# Altium schematic sheet TOF_VGA.SchDoc: =project_title
size Tabloid; CompanyName: Luxonis Holding; Organization: Luxonis Holding; Address1: 1925 Harmony Park Drive; Address2: Westminster, CO; Address3: 80234; Address4: United States; SheetNumber: 12; SheetTotal: 14
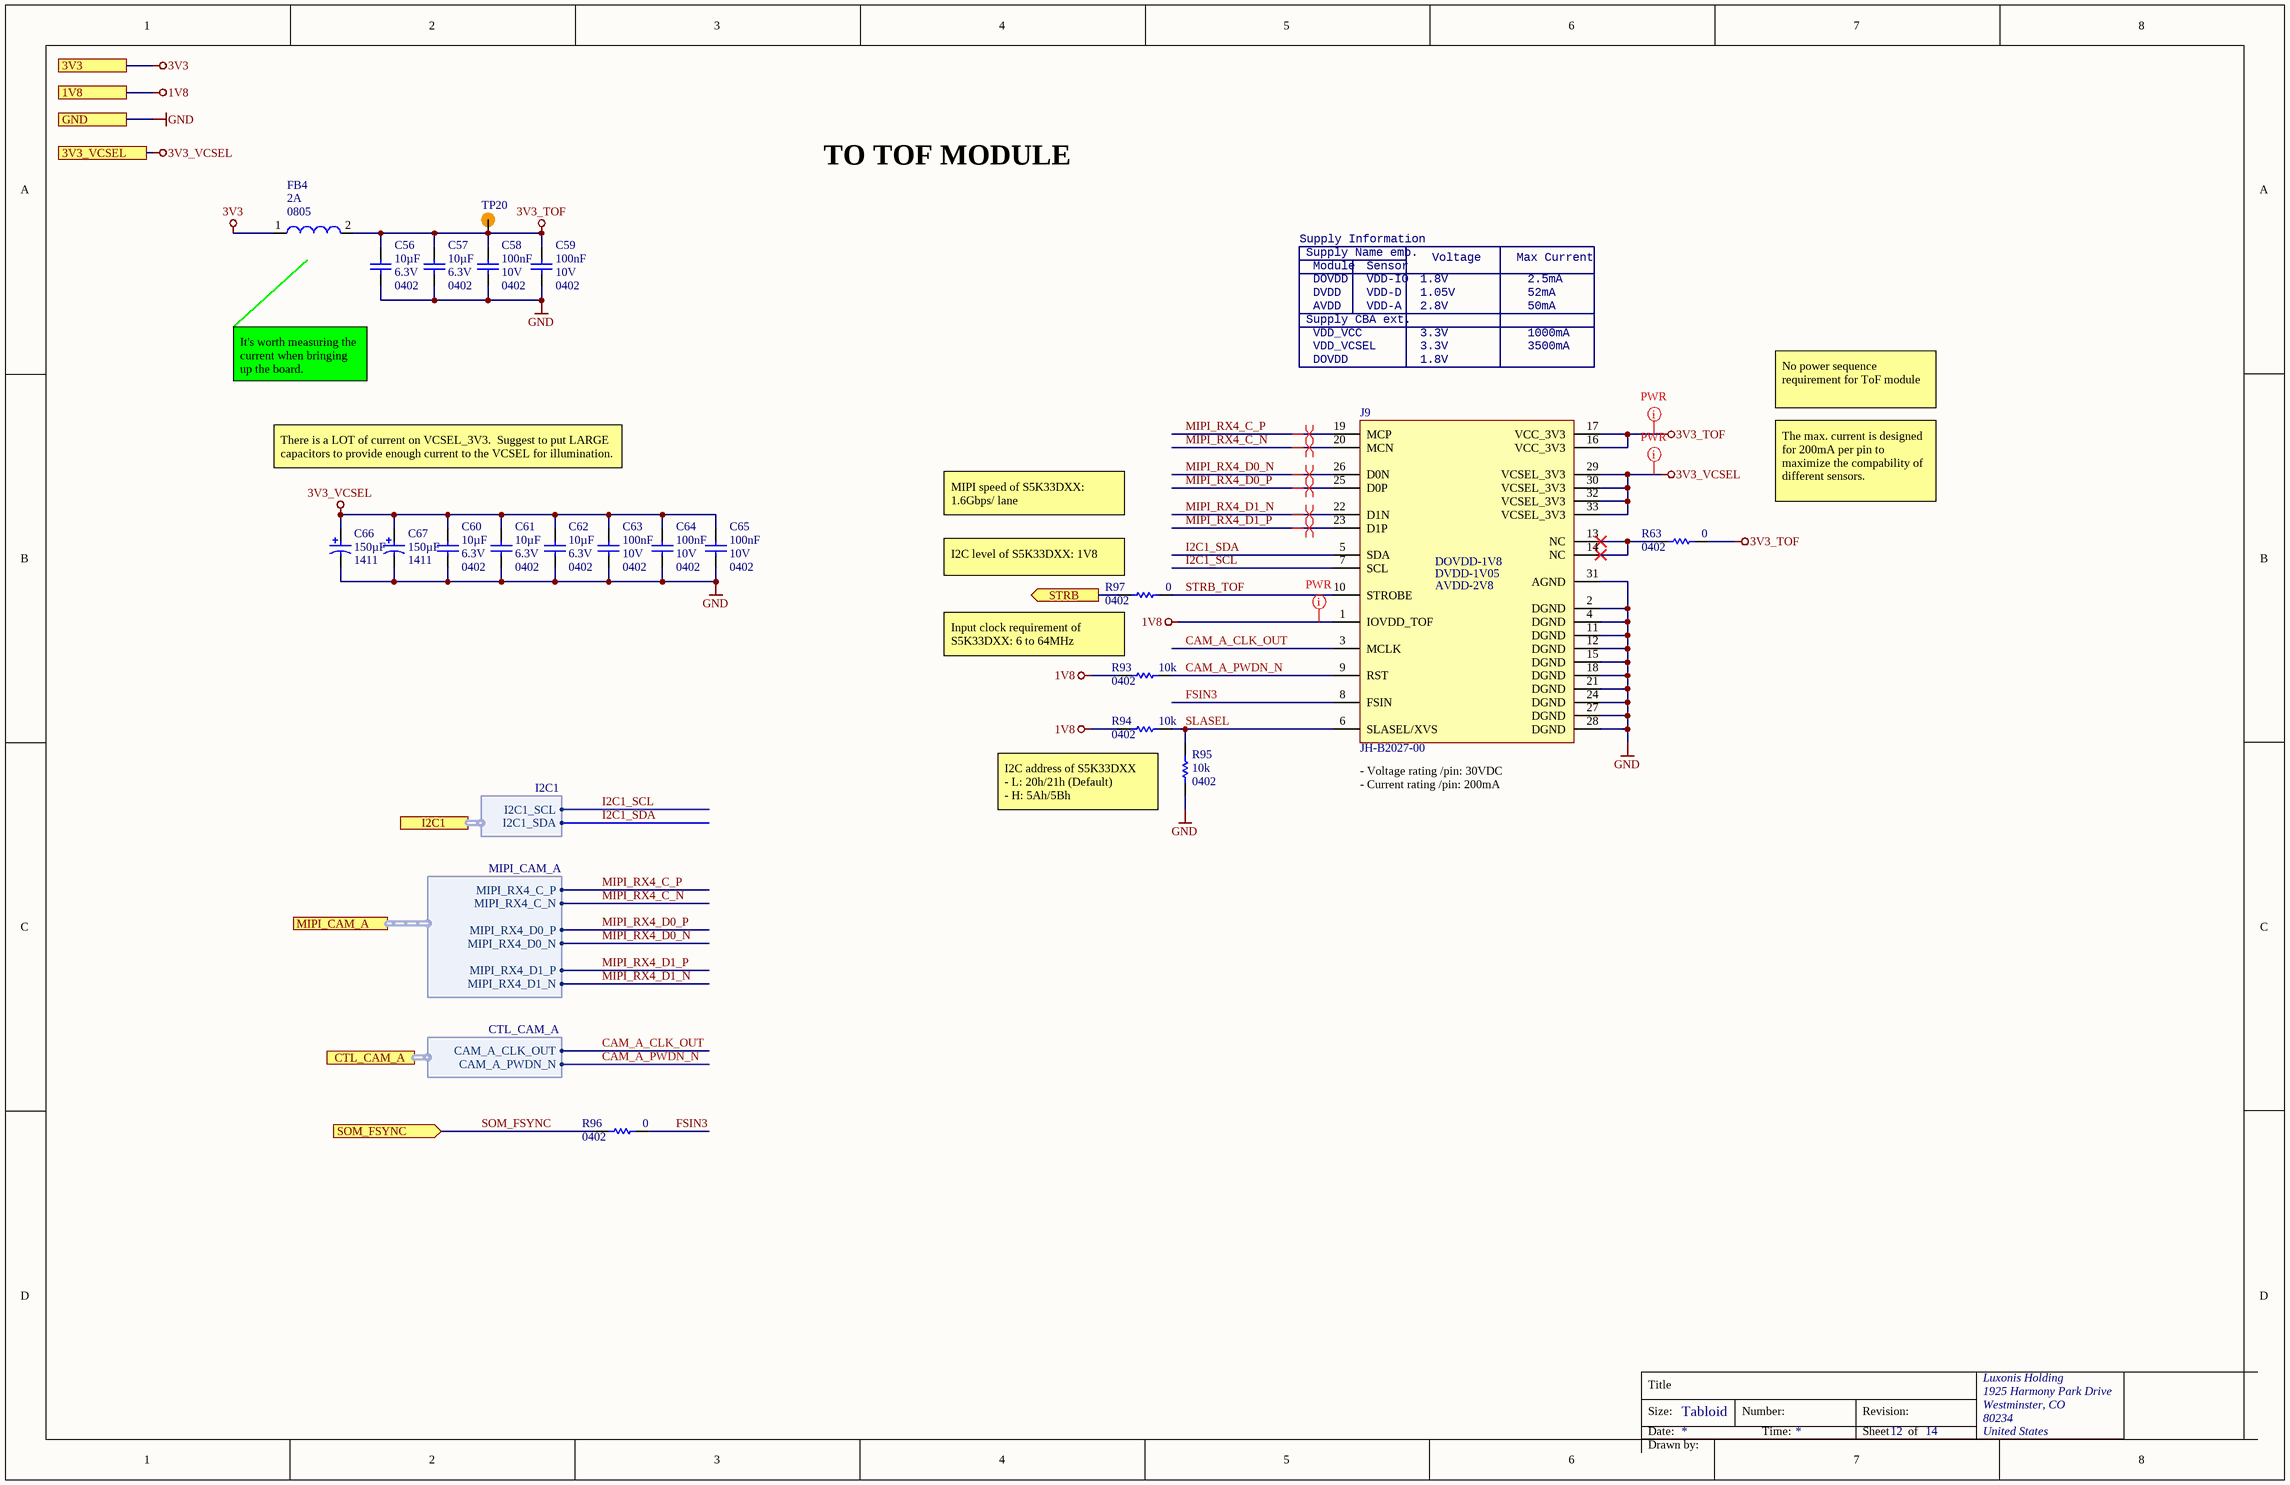
[diagram p0: TOF_VGA.SchDoc]

## Parts
C56  value 10µF  Case/Package: 0402  Voltage Rating: 6.3V  [CAPC0402(1005)70_N]  (hidden comment: GRM155R60J106ME15D)
C57  value 10µF  Case/Package: 0402  Voltage Rating: 6.3V  [CAPC0402(1005)70_N]  (hidden comment: GRM155R60J106ME15D)
C58  value 100nF  Voltage Rating: 10V  Case/Package: 0402  [CAPC0402(1005)70_N]  (hidden comment: GRM155R71A104JA01D)
C59  value 100nF  Voltage Rating: 10V  Case/Package: 0402  [CAPC0402(1005)70_N]  (hidden comment: GRM155R71A104JA01D)
C60  value 10µF  Case/Package: 0402  Voltage Rating: 6.3V  [CAPC0402(1005)70_N]  (hidden comment: GRM155R60J106ME15D)
C61  value 10µF  Case/Package: 0402  Voltage Rating: 6.3V  [CAPC0402(1005)70_N]  (hidden comment: GRM155R60J106ME15D)
C62  value 10µF  Case/Package: 0402  Voltage Rating: 6.3V  [CAPC0402(1005)70_N]  (hidden comment: GRM155R60J106ME15D)
C63  value 100nF  Voltage Rating: 10V  Case/Package: 0402  [CAPC0402(1005)70_N]  (hidden comment: GRM155R71A104JA01D)
C64  value 100nF  Voltage Rating: 10V  Case/Package: 0402  [CAPC0402(1005)70_N]  (hidden comment: GRM155R71A104JA01D)
C65  value 100nF  Voltage Rating: 10V  Case/Package: 0402  [CAPC0402(1005)70_N]  (hidden comment: GRM155R71A104JA01D)
C66  value 150µF  Case/Package: 1411  [RESTL1210(3225)_L]  (hidden comment: TLJB157M010R0500)
C67  value 150µF  Case/Package: 1411  [RESTL1210(3225)_L]  (hidden comment: TLJB157M010R0500)
FB4  Case/Package: 0805  Current Rating: 2A  [2508056017Y2]  (hidden comment: 2508056017Y2)
J9  JH-B2027-00  [PCBComponent_1]
R63  value 0  Case/Package: 0402  [RESC0402(1005)_L]  (hidden comment: CRCW04020000Z0ED)
R93  value 10k  Case/Package: 0402  [RESC0402(1005)_N]  (hidden comment: RC0402FR-1310KL)
R94  value 10k  Case/Package: 0402  [RESC0402(1005)_N]  (hidden comment: RC0402FR-1310KL)
R95  value 10k  Case/Package: 0402  [RESC0402(1005)_N]  (hidden comment: RC0402FR-1310KL)
R96  value 0  Case/Package: 0402  [RESC0402(1005)_L]  (hidden comment: CRCW04020000Z0ED)
R97  value 0  Case/Package: 0402  [RESC0402(1005)_L]  (hidden comment: CRCW04020000Z0ED)
TP20  TEST_POINT  [TP075_150_NS]  (value not drawn)  (no BOM)

## Ports
1V8, 3V3, 3V3_VCSEL, CTL_CAM_A (harness CTL_CAM_A), GND, I2C1 (harness I2C1), MIPI_CAM_A (harness MIPI_CAM_A), SOM_FSYNC (in), STRB (out)

## Harnesses
CTL_CAM_A: CAM_A_PWDN_N, CAM_A_CLK_OUT
MIPI_CAM_A: MIPI_RX4_C_P, MIPI_RX4_C_N, MIPI_RX4_D0_P, MIPI_RX4_D0_N, MIPI_RX4_D1_P, MIPI_RX4_D1_N
I2C1: I2C1_SDA, I2C1_SCL

## Nets
1V8: J9.1(IOVDD_TOF) R93.1 R94.1 ; port 1V8
3V3: FB4.1 ; port 3V3
3V3_TOF: C56.2 C57.2 C58.2 C59.2 FB4.2 J9.16(VCC_3V3) J9.17(VCC_3V3) R63.1 TP20.1
3V3_VCSEL: C60.2 C61.2 C62.2 C63.2 C64.2 C65.2 C66.1 C67.1 J9.29(VCSEL_3V3) J9.30(VCSEL_3V3) J9.32(VCSEL_3V3) J9.33(VCSEL_3V3) ; port 3V3_VCSEL
GND: C56.1 C57.1 C58.1 C59.1 C60.1 C61.1 C62.1 C63.1 C64.1 C65.1 C66.2 C67.2 J9.2(DGND) J9.4(DGND) J9.11(DGND) J9.12(DGND) J9.15(DGND) J9.18(DGND) J9.21(DGND) J9.24(DGND) J9.27(DGND) J9.28(DGND) J9.31(AGND) R95.1 ; port GND
CAM_A_CLK_OUT: J9.3(MCLK) ; port CTL_CAM_A.CAM_A_CLK_OUT
CAM_A_PWDN_N: J9.9(RST) R93.2 ; port CTL_CAM_A.CAM_A_PWDN_N
FSIN3: J9.8(FSIN) R96.1
I2C1_SCL: J9.7(SCL) ; port I2C1.I2C1_SCL
I2C1_SDA: J9.5(SDA) ; port I2C1.I2C1_SDA
MIPI_RX4_C_N: J9.20(MCN) ; port MIPI_CAM_A.MIPI_RX4_C_N
MIPI_RX4_C_P: J9.19(MCP) ; port MIPI_CAM_A.MIPI_RX4_C_P
MIPI_RX4_D0_N: J9.26(D0N) ; port MIPI_CAM_A.MIPI_RX4_D0_N
MIPI_RX4_D0_P: J9.25(D0P) ; port MIPI_CAM_A.MIPI_RX4_D0_P
MIPI_RX4_D1_N: J9.22(D1N) ; port MIPI_CAM_A.MIPI_RX4_D1_N
MIPI_RX4_D1_P: J9.23(D1P) ; port MIPI_CAM_A.MIPI_RX4_D1_P
SLASEL: J9.6(SLASEL/XVS) R94.2 R95.2
SOM_FSYNC: R96.2 ; port SOM_FSYNC
STRB: R97.2 ; port STRB
STRB_TOF: J9.10(STROBE) R97.1
NetJ9_13: J9.13(NC) J9.14(NC) R63.2

## Layout directives
differential pair; net class MIPI; differential pair class 100ohm: MIPI_RX4_C_N, MIPI_RX4_C_P, MIPI_RX4_D0_N, MIPI_RX4_D0_P, MIPI_RX4_D1_N, MIPI_RX4_D1_P
net class PWR; Current Rating: 3A: 3V3_VCSEL
net class PWR; Current Rating: 1A: 3V3_TOF
net class PWR; Current Rating: 200mA: 1V8

## Notes on the sheet
- TO TOF MODULE
- Supply Information
- Supply Name emb.
- DOVDD
- DVDD
- Module
- VDD-IO
- VDD-D
- Sensor
- 1.8V
- 1.05V
- Voltage
- Max Current
- 2.5mA
- 52mA
- Supply CBA ext.
- AVDD
- VDD_VCSEL
- VDD_VCC
- VDD-A
- 2.8V
- 3.3V
- 50mA
- 1000mA
- 3500mA
- It's worth measuring the current when bringing up the board.
- No power sequence requirement for ToF module
- There is a LOT of current on VCSEL_3V3.  Suggest to put LARGE capacitors to provide enough current to the VCSEL for illumination.
- The max. current is designed for 200mA per pin to maximize the compability of different sensors.
- (near R97) I2C level of S5K33DXX: 1V8
- MIPI speed of S5K33DXX: 1.6Gbps/ lane
- Input clock requirement of S5K33DXX: 6 to 64MHz
- I2C address of S5K33DXX
  - L: 20h/21h (Default)
  - H: 5Ah/5Bh
- (near J9) - Voltage rating /pin: 30VDC
  - Current rating /pin: 200mA
- Title
- Size:
- Date:
- Tabloid
- Number:
- Time:
- Revision:
- Sheet
- of
- Drawn by:
- (in symbol CMP-002-00132-2) DOVDD-1V8; DVDD-1V05; AVDD-2V8

## Library data of the parts
C56 C57 C60-C62 = CMP-004-000009-5: CAP CER 10UF 6.3V X5R 0402 20%; Manufacturer 1: Murata; Manufacturer Part Number 1: GRM155R60J106ME15D; Min Operating Temperature: -55°C; Max Operating Temperature: 85°C; Dielectric: X5R; Length: 0.039inch; Width: 0.02inch; ComponentLink1URL: https://www.murata.com/~/media/webrenewal/support/library/catalog/products/capacitor/mlcc/c02e.ashx?la=en-us&src-supplier=Digi-Key; ComponentLink1Description: https://www.murata.com/~/media/webrenewal/support/library/catalog/products/capacitor/mlcc/c02e.ashx?la=en-us&src-supplier=Digi-Key; Tolerance: 20%; Design Item ID: GRM155R60J106ME15D; Mounting Technology: SMT
C58 C59 C63-C65 = CMP-108-000015-5: CAP CER 0.1UF 10V X7R 0402 5%; Manufacturer 1: Murata; Dielectric: X7R; Tolerance: 5%; Min Operating Temperature: -55°C; Mounting Technology: SMT; Max Operating Temperature: 125°C; Depth: 0.5mm; Height: 0.5mm; ComponentLink2Description: https://datasheet.ciiva.com/11618/c02e-11618821.pdf?src-supplier=Avnet; Length: 1mm; Width: 0.02inch; ComponentLink1URL: https://datasheet.ciiva.com/5411/product-5411135.pdf?src-supplier=Mouser; Design Item ID: GRM155R71A104JA01D; ComponentLink1Description: https://datasheet.ciiva.com/5411/product-5411135.pdf?src-supplier=Mouser; Manufacturer Part Number 1: GRM155R71A104JA01D; ComponentLink2URL: https://datasheet.ciiva.com/11618/c02e-11618821.pdf?src-supplier=Avnet
C66 C67 = CMP-050-000000-4: CAP TAL 150UF 10V 20%; Manufacturer 1: Kyocera AVX; Capacitor Type: Tantalum; Polarity: Polarized; ComponentLink5Description: https://datasheet.ciiva.com/46385/1910903-46385237.pdf?src-supplier=Element14; Manufacturer Part Number 1: TLJB157M010R0500; Min Operating Temperature: -55°C; ComponentLink6Description: https://datasheet.ciiva.com/28515/tlj-28515528.pdf?src-supplier=Element14; ComponentLink4URL: https://datasheet.ciiva.com/264/tlj-264788.pdf?src-supplier=Digi-Key; ComponentLink5URL: https://datasheet.ciiva.com/46385/1910903-46385237.pdf?src-supplier=Element14; Length: 3.5mm; ComponentLink2URL: https://datasheet.ciiva.com/264/tlj-264786.pdf?src-supplier=Digi-Key; ComponentLink10URL: https://datasheet.ciiva.com/7773/1533257-7773834.pdf?src-supplier=Element14; ComponentLink11URL: https://datasheet.ciiva.com/11229/tlj-11229389.pdf?src-supplier=Avnet; Design Item ID: TLJB157M010R0500; ComponentLink10Description: https://datasheet.ciiva.com/7773/1533257-7773834.pdf?src-supplier=Element14; ComponentLink11Description: https://datasheet.ciiva.com/11229/tlj-11229389.pdf?src-supplier=Avnet; ComponentLink12URL: https://datasheet.ciiva.com/17339/tlj-17339422.pdf?src-supplier=Avnet+Europe; Mounting Technology: SMT; ComponentLink3URL: https://datasheet.ciiva.com/264/tlj-264787.pdf?src-supplier=Digi-Key; ComponentLink1Description: https://datasheet.ciiva.com:443/pdfs/VipMasterIC/IC/AVXC/AVXC-S-A0008508048/AVXC-S-A0008508048-1.pdf?src-supplier=IHS+Markit; ComponentLink12Description: https://datasheet.ciiva.com/17339/tlj-17339422.pdf?src-supplier=Avnet+Europe; ComponentLink7Description: https://datasheet.ciiva.com/7773/1533257-7773833.pdf?src-supplier=Element14; ComponentLink3Description: https://datasheet.ciiva.com/264/tlj-264787.pdf?src-supplier=Digi-Key; Max Operating Temperature: 125°C; Voltage Rating: 10V; ComponentLink8Description: https://datasheet.ciiva.com/14593/70001364-14593673.pdf?src-supplier=Allied+Electronics; Width: 2.8mm; ComponentLink2Description: https://datasheet.ciiva.com/264/tlj-264786.pdf?src-supplier=Digi-Key; ComponentLink7URL: https://datasheet.ciiva.com/7773/1533257-7773833.pdf?src-supplier=Element14; ComponentLink9URL: https://datasheet.ciiva.com/14606/70001364-14606409.pdf?src-supplier=Allied+Electronics; ComponentLink6URL: https://datasheet.ciiva.com/28515/tlj-28515528.pdf?src-supplier=Element14; ComponentLink4Description: https://datasheet.ciiva.com/264/tlj-264788.pdf?src-supplier=Digi-Key; ComponentLink9Description: https://datasheet.ciiva.com/14606/70001364-14606409.pdf?src-supplier=Allied+Electronics; ComponentLink8URL: https://datasheet.ciiva.com/14593/70001364-14593673.pdf?src-supplier=Allied+Electronics; ComponentLink1URL: https://datasheet.ciiva.com:443/pdfs/VipMasterIC/IC/AVXC/AVXC-S-A0008508048/AVXC-S-A0008508048-1.pdf?src-supplier=IHS+Markit; Height: 1.9mm; Tolerance: 20%
FB4 = CMP-082-000000-2: FERRITE BEAD, 0.1OHM, 2A, 0805, 600R/100MHz; Manufacturer 1: Fair-Rite; Tolerance: 25%; Manufacturer Part Number 1: 2508056017Y2
J9 = CMP-002-00132-2: FFC/FPC Connector, 33 Contact(s), 1 Row(s), Female, Right Angle, Surface Mount Terminal; Manufacturer 1: Hirose; Manufacturer Part Number 1: FH26W-33S-0.3SHW(60); ComponentLink1URL: https://datasheet.ciiva.com:443/pdfs/VipMasterIC/IC/HIRO/HIRO-S-A0007913874/HIRO-S-A0008593114-1.pdf?src-supplier=IHS+Markit; Design Item ID: AC_PY004-IMX378_CON; Category: FFC / FPC; ComponentLink2Description: https://www.hirose.com/product/en/download_file/key_name/FH26/category/Catalog/doc_file_id/49355/?file_category_id=4&item_id=298&is_series=1&src-supplier=Digi-Key; Pricing 1: 1=1,78000, 10=1,61700, 25=1,51800, 50=1,45200, 100=1,38600, 250=1,25400, 500=1,15500, 1000=0,99000, 2500=0,92400 (USD); Source: LuxonisMaster.SchLib; ComponentLink3URL: https://www.hirose.com/product/download/?distributor=digikey&amp;type=2d&amp;lang=en&amp;num=FH26W-13S-0.3SHW(60)&src-supplier=Digi-Key; ComponentLink1Description: https://datasheet.ciiva.com:443/pdfs/VipMasterIC/IC/HIRO/HIRO-S-A0007913874/HIRO-S-A0008593114-1.pdf?src-supplier=IHS+Markit; Pins: 33; Stock 1: 627; ComponentLink2URL: https://www.hirose.com/product/en/download_file/key_name/FH26/category/Catalog/doc_file_id/49355/?file_category_id=4&item_id=298&is_series=1&src-supplier=Digi-Key; ComponentLink3Description: https://www.hirose.com/product/download/?distributor=digikey&amp;type=2d&amp;lang=en&amp;num=FH26W-13S-0.3SHW(60)&src-supplier=Digi-Key; RoHS: Yes
R63 R96 R97 = CMP-013-000022-11: RES SMD 0 OHM 5% 1/16W 0402; Manufacturer 1: Vishay; Voltage Rating: 50V; Power Rating: 63mW; Max Operating Temperature: 155°C; Manufacturer Part Number 1: CRCW04020000Z0ED; Tolerance: 5%; Min Operating Temperature: -55°C; Design Item ID: CRCW04020000Z0ED
R93-R95 = CMP-115-000004-8: RES SMD 10K OHM 1% 1/16W 0402; Manufacturer 1: Yageo; Power Rating: 62.5mW; Temperature Coefficient: 100ppm/°C; Voltage Rating: 50V; Min Operating Temperature: -55°C; Max Operating Temperature: 155°C; Design Item ID: RC0402FR-1310KL; Tolerance: 1%; Manufacturer Part Number 1: RC0402FR-1310KL
TP20 = CMP-015-000000-2: Manufacturer Part Number 1: /; Source: LuxonisMaster.SchLib; Design Item ID: TEST_POINT